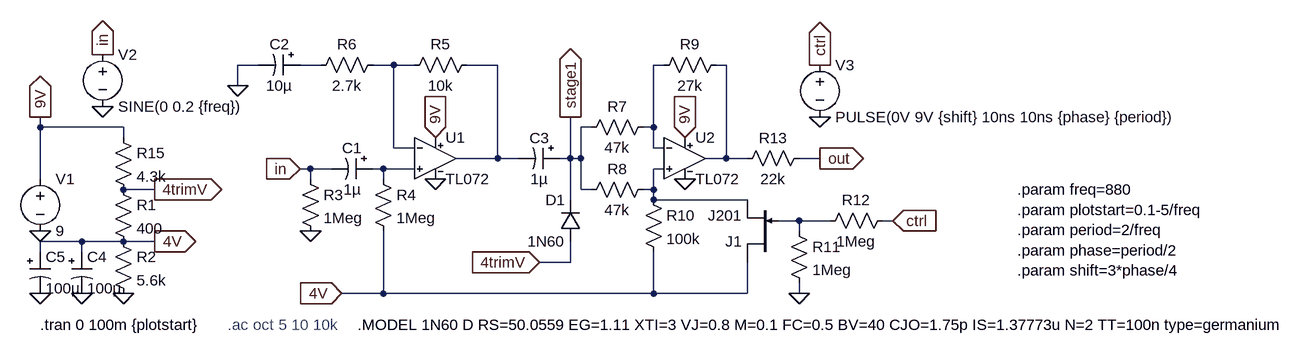
[diagram p0: schematic OC2-subgenerator.asc]
OC2-subgenerator.asc, the LTspice schematic file:
Version 4
SHEET 1 1796 704
WIRE 80 176 48 176
WIRE 176 176 144 176
WIRE 288 176 256 176
WIRE 320 176 288 176
WIRE 448 176 400 176
WIRE 704 176 688 176
WIRE 800 176 784 176
WIRE 48 208 48 176
WIRE -256 272 -256 256
WIRE -128 272 -256 272
WIRE 592 272 576 272
WIRE 688 272 688 176
WIRE 688 272 672 272
WIRE -128 288 -128 272
WIRE 288 304 288 176
WIRE 320 304 288 304
WIRE 688 304 688 272
WIRE 704 304 688 304
WIRE 448 320 448 176
WIRE 448 320 384 320
WIRE 480 320 448 320
WIRE 560 320 560 256
WIRE 560 320 544 320
WIRE 576 320 576 272
WIRE 576 320 560 320
WIRE 800 320 800 176
WIRE 800 320 768 320
WIRE 832 320 800 320
WIRE 944 320 912 320
WIRE 160 336 144 336
WIRE 192 336 160 336
WIRE 272 336 256 336
WIRE 320 336 272 336
WIRE 704 336 688 336
WIRE -256 352 -256 272
WIRE 160 352 160 336
WIRE 272 352 272 336
WIRE -80 368 -128 368
WIRE 576 368 576 320
WIRE 592 368 576 368
WIRE 688 368 688 336
WIRE 688 368 672 368
WIRE 560 384 560 320
WIRE 688 384 688 368
WIRE 832 384 688 384
WIRE 912 416 880 416
WIRE 960 416 912 416
WIRE 1056 416 1040 416
WIRE 912 432 912 416
WIRE -192 448 -256 448
WIRE -128 448 -192 448
WIRE -80 448 -128 448
WIRE -256 464 -256 448
WIRE -192 464 -192 448
WIRE 560 480 560 448
WIRE 560 480 512 480
WIRE 272 528 272 432
WIRE 272 528 208 528
WIRE 688 528 688 464
WIRE 688 528 272 528
WIRE 832 528 832 480
WIRE 832 528 688 528
WIRE 912 528 912 512
FLAG -128 528 0
FLAG -256 432 0
FLAG -256 256 9V
IOPIN -256 256 Out
FLAG -80 448 4V
IOPIN -80 448 Out
FLAG 352 352 0
FLAG 352 288 9V
IOPIN 352 288 In
FLAG 144 336 in
IOPIN 144 336 In
FLAG 160 432 0
FLAG 208 528 4V
IOPIN 208 528 In
FLAG 48 208 0
FLAG 944 320 out
IOPIN 944 320 Out
FLAG -160 240 0
FLAG -160 160 in
IOPIN -160 160 Out
FLAG 736 352 0
FLAG 736 288 9V
IOPIN 736 288 In
FLAG 1056 416 ctrl
IOPIN 1056 416 In
FLAG 944 256 0
FLAG 944 176 ctrl
IOPIN 944 176 Out
FLAG 912 528 0
FLAG -256 528 0
FLAG -192 528 0
FLAG -80 368 4trimV
IOPIN -80 368 Out
FLAG 512 480 4trimV
IOPIN 512 480 In
FLAG 560 256 stage1
IOPIN 560 256 Out
SYMBOL TL072 352 256 R0
SYMATTR InstName U1
SYMBOL Voltage -256 336 R0
SYMATTR InstName V1
SYMATTR Value 9
SYMBOL Res -144 352 R0
SYMATTR InstName R1
SYMATTR Value 400
SYMBOL Res -144 432 R0
SYMATTR InstName R2
SYMATTR Value 5.6k
SYMBOL polcap 256 320 R90
WINDOW 0 0 32 VBottom 2
WINDOW 3 32 32 VTop 2
SYMATTR InstName C1
SYMATTR Value 1µ
SYMBOL Res 144 336 R0
SYMATTR InstName R3
SYMATTR Value 1Meg
SYMBOL Res 256 336 R0
SYMATTR InstName R4
SYMATTR Value 1Meg
SYMBOL Res 416 160 R90
WINDOW 0 0 56 VBottom 2
WINDOW 3 32 56 VTop 2
SYMATTR InstName R5
SYMATTR Value 10k
SYMBOL Res 272 160 R90
WINDOW 0 0 56 VBottom 2
WINDOW 3 32 56 VTop 2
SYMATTR InstName R6
SYMATTR Value 2.7k
SYMBOL polcap 144 160 R90
WINDOW 0 0 32 VBottom 2
WINDOW 3 32 32 VTop 2
SYMATTR InstName C2
SYMATTR Value 10µ
SYMBOL Voltage -160 144 R0
SYMATTR InstName V2
SYMATTR Value SINE(0 0.2 {freq})
SYMATTR Value2 AC 0.2
SYMBOL polcap 544 304 R90
WINDOW 0 0 32 VBottom 2
WINDOW 3 32 32 VTop 2
SYMATTR InstName C3
SYMATTR Value 1µ
SYMBOL Res 688 256 R90
WINDOW 0 0 56 VBottom 2
WINDOW 3 32 56 VTop 2
SYMATTR InstName R7
SYMATTR Value 47k
SYMBOL Res 688 352 R90
WINDOW 0 0 56 VBottom 2
WINDOW 3 32 56 VTop 2
SYMATTR InstName R8
SYMATTR Value 47k
SYMBOL diode 576 448 R180
WINDOW 0 24 64 Left 2
WINDOW 3 24 0 Left 2
SYMATTR InstName D1
SYMATTR Value 1N60
SYMBOL TL072 736 256 R0
SYMATTR InstName U2
SYMBOL Res 800 160 R90
WINDOW 0 0 56 VBottom 2
WINDOW 3 32 56 VTop 2
SYMATTR InstName R9
SYMATTR Value 27k
SYMBOL Res 672 368 R0
SYMATTR InstName R10
SYMATTR Value 100k
SYMBOL njf 880 480 R180
SYMATTR InstName J1
SYMATTR Value J201
SYMBOL Res 896 416 R0
SYMATTR InstName R11
SYMATTR Value 1Meg
SYMBOL Res 1056 400 R90
WINDOW 0 0 56 VBottom 2
WINDOW 3 32 56 VTop 2
SYMATTR InstName R12
SYMATTR Value 1Meg
SYMBOL Res 928 304 R90
WINDOW 0 0 56 VBottom 2
WINDOW 3 32 56 VTop 2
SYMATTR InstName R13
SYMATTR Value 22k
SYMBOL Voltage 944 160 R0
SYMATTR InstName V3
SYMATTR Value PULSE(0V 9V {shift} 10ns 10ns {phase} {period})
SYMBOL polcap -208 464 R0
SYMATTR InstName C4
SYMATTR Value 100µ
SYMBOL polcap -272 464 R0
SYMATTR InstName C5
SYMATTR Value 100µ
SYMBOL Res -144 272 R0
SYMATTR InstName R15
SYMATTR Value 4.3k
TEXT -256 576 Left 2 !.tran 0 100m {plotstart}
TEXT 32 576 Left 2 ;.ac oct 5 10 10k
TEXT 232 576 Left 2 !.MODEL 1N60 D RS=50.0559 EG=1.11 XTI=3 VJ=0.8 M=0.1 FC=0.5 BV=40 CJO=1.75p IS=1.37773u N=2 TT=100n type=germanium
TEXT 1248 368 Left 2 !.param freq=880\n.param plotstart=0.1-5/freq\n.param period=2/freq\n.param phase=period/2\n.param shift=3*phase/4

The netlist it stands for:
* OC2-subgenerator.asc
XU1 N006 N002 9V 0 N003 TL072  ; pins In+ In- V+ V- OUT
V1 9V 0 9
R1 4trimV 4V 400
R2 4V 0 5.6k
C1 N006 in 1µ
R3 in 0 1Meg
R4 N006 4V 1Meg
R5 N003 N002 10k
R6 N002 N001 2.7k
C2 N001 0 10µ
V2 in 0 SINE(0 0.2 {freq}) AC 0.2
C3 stage1 N003 1µ
R7 N004 stage1 47k
R8 N007 stage1 47k
D1 4trimV stage1 1N60
XU2 N007 N004 9V 0 N005 TL072  ; pins In+ In- V+ V- OUT
R9 N005 N004 27k
R10 N007 4V 100k
J1 4V N008 N007 J201
R11 N008 0 1Meg
R12 ctrl N008 1Meg
R13 out N005 22k
V3 ctrl 0 PULSE(0V 9V {shift} 10ns 10ns {phase} {period})
C4 4V 0 100µ
C5 4V 0 100µ
R15 9V 4trimV 4.3k
.model D D
.lib standard.dio
.model NJF NJF
.model PJF PJF
.lib standard.jft
.tran 0 100m {plotstart}
* .ac oct 5 10 10k
.MODEL 1N60 D RS=50.0559 EG=1.11 XTI=3 VJ=0.8 M=0.1 FC=0.5 BV=40 CJO=1.75p IS=1.37773u N=2 TT=100n type=germanium
.param freq=880
.param plotstart=0.1-5/freq
.param period=2/freq
.param phase=period/2
.param shift=3*phase/4
.lib TL072.sub
.backanno
.end